# EAGLE design Power Supply 2 (EAGLE 8.6.0)
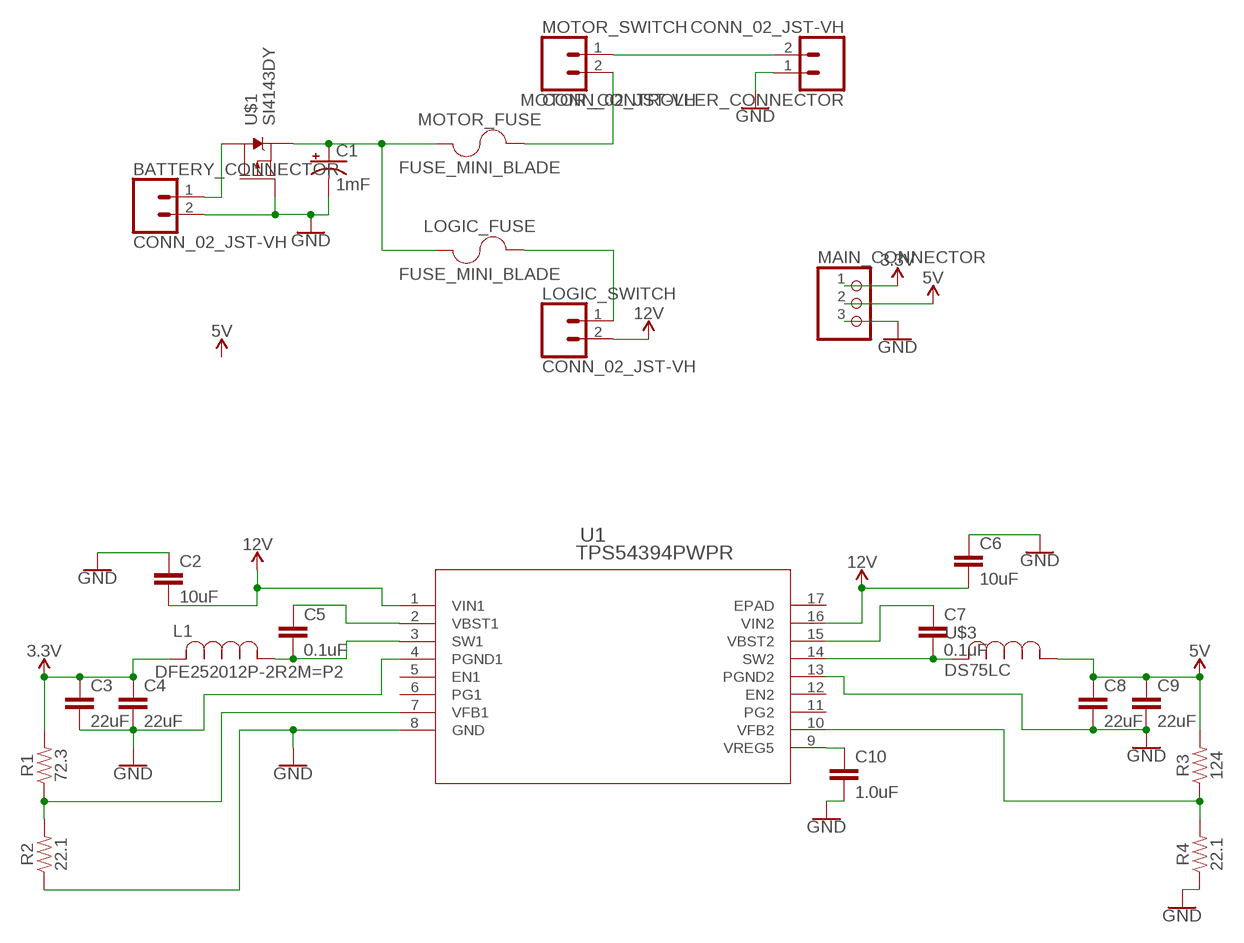
[diagram p0: schematic, sheet 1]

## Parts
BATTERY_CONNECTOR  CONN_02_JST-VH  [B2P-VH]
C1  1mF  1000UF-RADIAL-5MM-25V-20%  [CPOL-RADIAL-5MM-10MM]
C2  10uF  10UF-0805-10V-10%  [0805]
C3  22uF  22UF-0805-6.3V-20%  [0805]
C4  22uF  22UF-0805-6.3V-20%  [0805]
C5  0.1uF  0.1UF-0603-25V-5%  [0603]
C6  10uF  10UF-0805-10V-10%  [0805]
C7  0.1uF  0.1UF-0603-25V-5%  [0603]
C8  22uF  22UF-0805-6.3V-20%  [0805]
C9  22uF  22UF-0805-6.3V-20%  [0805]
C10  1.0uF  1.0UF-0805-25V-10%  [0805]
L1  DFE252012P-2R2M=P2  [DFE252012P-1R0M=P2]
LOGIC_FUSE  FUSE_MINI_BLADE  [SL-1538]
LOGIC_SWITCH  CONN_02_JST-VH  [B2P-VH]
MAIN_CONNECTOR  PINHD-1X3  [1X03]
MOTOR_CONTROLLER_CONNECTOR  CONN_02_JST-VH  [B2P-VH]
MOTOR_FUSE  FUSE_MINI_BLADE  [SL-1538]
MOTOR_SWITCH  CONN_02_JST-VH  [B2P-VH]
R1  72.3  75KOHM-0603-1/10W-1%  [0603]
R2  22.1  75KOHM-0603-1/10W-1%  [0603]
R3  124  75KOHM-0603-1/10W-1%  [0603]
R4  22.1  75KOHM-0603-1/10W-1%  [0603]
U1  TPS54394PWPR  [PWP16_3P4X2P46]
U$1  SI4143DY  [SO-8]
U$3  DS75LC  [DS75LC]

## Nets
3.3V: C3.1 C4.1 L1.2 MAIN_CONNECTOR.1 R1.2
5V: C8.1 C9.1 MAIN_CONNECTOR.2 R3.2 U$3.P$1
12V: C2.2 C6.2 LOGIC_SWITCH.2 U1.1(VIN1) U1.16(VIN2)
GND: BATTERY_CONNECTOR.2 C1.- C2.1 C3.2 C4.2 C6.1 C8.2 C9.2 C10.2 MAIN_CONNECTOR.3 MOTOR_CONTROLLER_CONNECTOR.1 R2.1 R4.1 U1.4(PGND1) U1.8(GND) U1.13(PGND2) U$1.4(G)
N$1: BATTERY_CONNECTOR.1 U$1.5(D) U$1.6(D) U$1.7(D) U$1.8(D)
N$2: MOTOR_FUSE.P$2 MOTOR_SWITCH.2
N$3: C1.+ LOGIC_FUSE.P$1 MOTOR_FUSE.P$1 U$1.1(S) U$1.2(S) U$1.3(S)
N$4: LOGIC_FUSE.P$2 LOGIC_SWITCH.1
N$5: MOTOR_CONTROLLER_CONNECTOR.2 MOTOR_SWITCH.1
N$6: C5.1 U1.2(VBST1)
N$7: C5.2 L1.1 U1.3(SW1)
N$8: C7.1 U1.15(VBST2)
N$9: R1.1 R2.2 U1.7(VFB1)
N$10: C7.2 U1.14(SW2) U$3.P$2
N$11: C10.1 U1.9(VREG5)
N$14: R3.1 R4.2 U1.10(VFB2)
Unconnected: U1.5(EN1) U1.6(PG1) U1.11(PG2) U1.12(EN2) U1.17(EPAD)

## Library data of the parts
BATTERY_CONNECTOR LOGIC_SWITCH MOTOR_CONTROLLER_CONNECTOR MOTOR_SWITCH = JST-VH:CONN_02_JST-VH: B2P-VH(LF)(SN) Digikey <https://www.digikey.com.au/product-detail/en/jst-sales-america-inc/B2P-VH-LF-SN/455-1639-ND/926547>
C1 = SparkFun-Capacitors:1000UF: 1,000µF/1mF ceramic capacitors A capacitor is a passive two-terminal electrical component used to store electrical energy temporarily in an electric field. CAP-08070; PROD_ID: CAP-09538
C2 C6 = SparkFun-Capacitors:10UF: 10.0µF ceramic capacitors A capacitor is a passive two-terminal electrical component used to store electrical energy temporarily in an electric field.; PROD_ID: CAP-11330
C3 C4 C8 C9 = SparkFun-Capacitors:22UF: 22µF ceramic capacitors A capacitor is a passive two-terminal electrical component used to store electrical energy temporarily in an electric field.; PROD_ID: CAP-08402
C5 C7 = SparkFun-Capacitors:0.1UF: 0.1µF ceramic capacitors A capacitor is a passive two-terminal electrical component used to store electrical energy temporarily in an electric field.; PROD_ID: CAP-08604
C10 = SparkFun-Capacitors:1.0UF: 1µF ceramic capacitors A capacitor is a passive two-terminal electrical component used to store electrical energy temporarily in an electric field.; PROD_ID: CAP-08064
L1 = Inductor:DFE252012P-2R2M=P2; MANUFACTURER_PART_NUMBER: DFE252012P2R2M=P2; VENDOR: Murata
LOGIC_FUSE MOTOR_FUSE = Fuse_Holder:FUSE_MINI_BLADE: SL-1538 Aliexpress <https://www.aliexpress.com/item/SL-1538-MINI-Style-Blade-Fuse-Holers-PCB-Mount-Fuse-holders-0153008/503553051.html>
MAIN_CONNECTOR = PinHead+:PINHD-1X3: PIN HEADER
R1-R4 = SparkFun-Resistors:75KOHM: 75Ω resistor A resistor is a passive two-terminal electrical component that implements electrical resistance as a circuit element. Resistors act to reduce current flow, and, at the same time, act to lower voltage levels within circuits. - Wikipedia; PROD_ID: RES-09737; VALUE: 75
U1 = TPS54394PWP:TPS54394PWPR; MANUFACTURER_PART_NUMBER: TPS54394PWPR; VENDOR: Texas Instruments
U$1 = MOSFET:SI4143DY: MOSFET P-CHANNEL 30V 25.3A 8SO Digikey <https://www.digikey.com.au/product-detail/en/vishay-siliconix/SI4143DY-T1-GE3/SI4143DY-T1-GE3CT-ND/6834487>
U$3 = Inductor:DS75LC

## Board
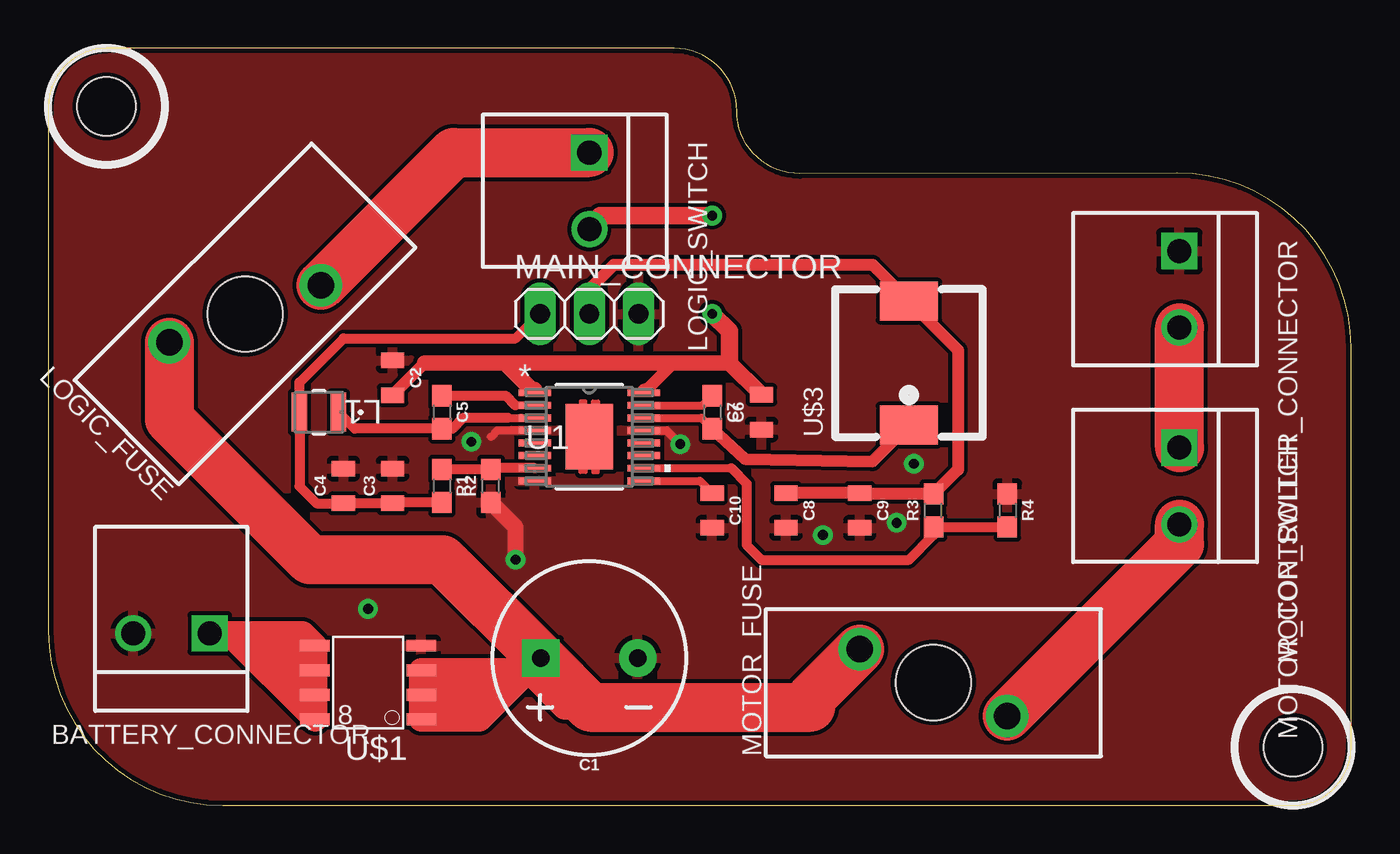
[diagram p1: board, top side]
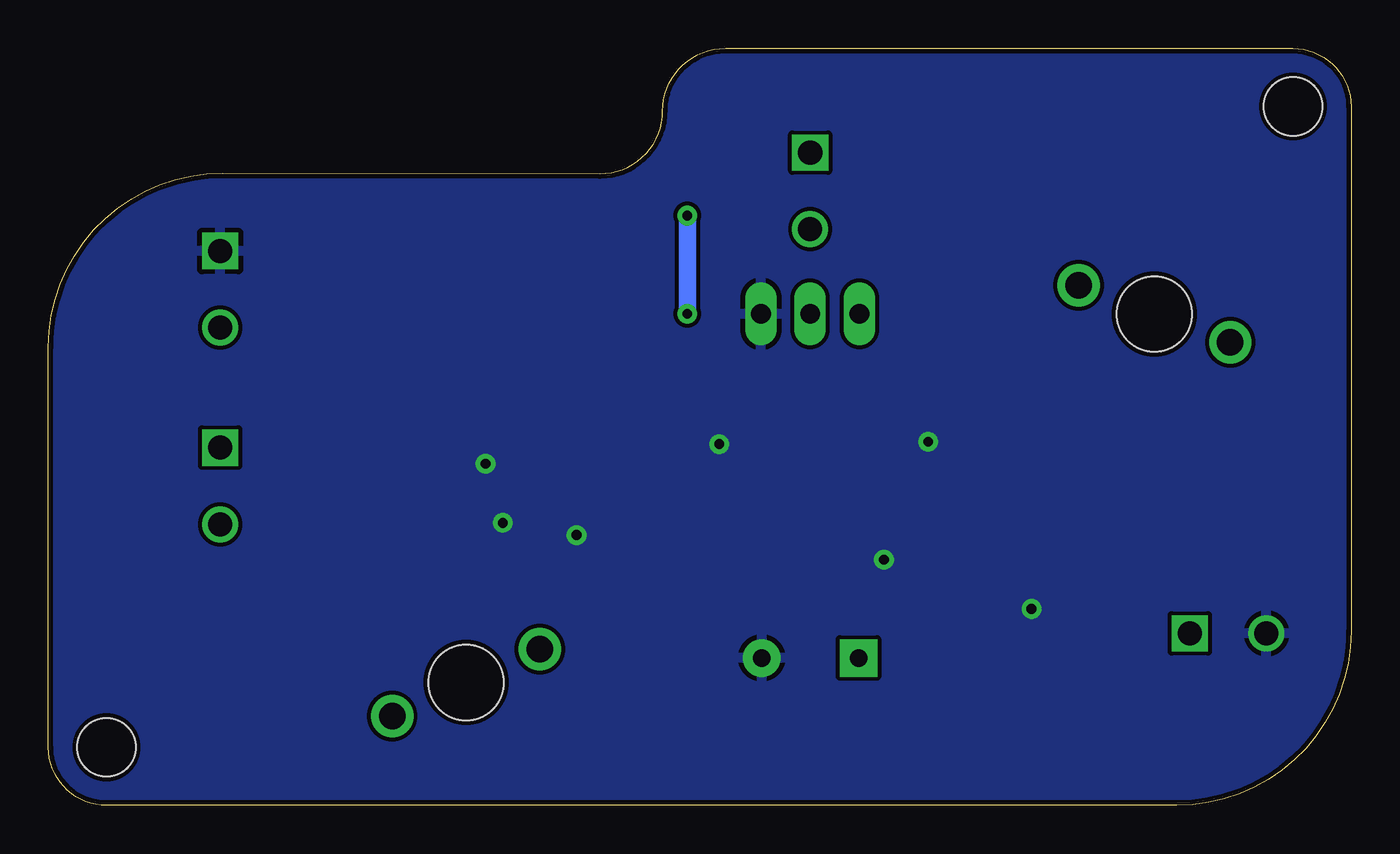
[diagram p2: board, bottom side, seen from below]

Size 67.29 x 39.12 mm. Coordinates in mm from the lower left corner, seen from the top.
Outline: 0,36.12 0,9 arc90 9,0 64.29,0 arc90 67.29,3 67.29,23.68 arc90 58.28,32.68 38.8,32.64 arc-90 35.56,35.88 arc90 32.32,39.12 3,39.12 arc90 0,36.12
Copper layers (1*16): Top 0.035mm / dielectric 1.5mm / Bottom 0.035mm
Design rules "SparkFun": minimum track width 8mil, minimum drill 20mil, track to track 8mil, track to pad 8mil, pad to pad 8mil, via to via 8mil, smd to smd 8mil, copper to edge 10mil, drill to drill 8mil, minimum pad ring 12mil, minimum via ring 10mil, stop-mask expansion 4mil, vias tented up to drill 25mil, thermal gap 10mil
Holes 3 mm at 3,36.12 64.29,3

### Footprints (pad centres in the part's own frame; a part is rotated, then mirrored left to right if it is on the bottom)
B2P-VH = drill 1.25 square: 1 -1.98,0 | drill 1.24: 2 1.98,0
CPOL-RADIAL-5MM-10MM = drill 0.9 pad 1.93 square: + 2.5,0 | drill 0.9 pad 1.93: - -2.5,0
0805 = smd 0.8 x 1.2: 1 -0.9,0; 2 0.9,0
0603 = smd 1.1 x 1: 1 -0.85,0; 2 0.85,0
DFE252012P-1R0M=P2 = smd 0.8 x 2.007: 1 -1,0; 2 1,0
SL-1538 = drill 1.37 pad 2.184: P$1 1.73,3.81; P$2 -1.73,-3.81 | hole 3.88: 0,0
1X03 = drill 1.016 long: 1 -2.54,0; 2 0,0; 3 2.54,0
PWP16_3P4X2P46 = smd 1.676 x 0.356: 1 -2.819,2.275; 2 -2.819,1.625; 3 -2.819,0.975; 4 -2.819,0.325; 5 -2.819,-0.325; 6 -2.819,-0.975; 7 -2.819,-1.625; 8 -2.819,-2.275; 9 2.819,-2.275; 10 2.819,-1.625; 11 2.819,-0.975; 12 2.819,-0.325; 13 2.819,0.325; 14 2.819,0.975; 15 2.819,1.625; 16 2.819,2.275 | smd 2.46 x 3.4: 17 0,0
SO-8 = smd 1.524 x 0.61: 1 -2.743,1.905; 2 -2.743,0.635; 3 -2.743,-0.635; 4 -2.743,-1.905; 5 2.743,-1.905; 6 2.743,-0.635; 7 2.743,0.635; 8 2.743,1.905
DS75LC = smd 2 x 3: P$1 3.2,0; P$2 -3.2,0

### Placement (x,y rotation side)
BATTERY_CONNECTOR  6.35,8.89 180 top
C1  27.94,7.62 180 top
C2  17.78,22.1 270 top
C3  17.78,16.51 90 top
C4  15.24,16.51 90 top
C5  20.32,20.32 270 top
C6  36.83,20.32 90 top
C7  34.29,20.32 270 top
C8  38.1,15.24 270 top
C9  41.91,15.24 270 top
C10  34.29,15.24 270 top
L1  13.97,20.32 180 top
LOGIC_FUSE  10.16,25.4 135 top
LOGIC_SWITCH  27.94,31.75 270 top
MAIN_CONNECTOR  27.94,25.4 0 top
MOTOR_CONTROLLER_CONNECTOR  58.42,26.67 270 top
MOTOR_FUSE  45.72,6.35 90 top
MOTOR_SWITCH  58.42,16.51 270 top
R1  20.32,16.51 270 top
R2  22.86,16.51 90 top
R3  45.72,15.24 90 top
R4  49.53,15.24 270 top
U1  27.94,19.05 0 top
U$1  16.51,6.35 180 top
U$3  44.45,22.86 90 top

### Tracks (layer width: path | path; a pad name or v marks a point on that pad's centre or on a via)
3.3V
  Top 0.508: R1.2 17.83,15.66 C3.1 C4.1 13.85,15.61 12.97,16.49 L1.2 12.97,21.86 15.24,24.13 24.13,24.13 MAIN_CONNECTOR.1
5V
  Top 0.61: C8.1 C9.1 41.96,16.09 R3.2 46.99,17.36 46.99,23.52 U$3.P$1 42.57,27.94 29.21,27.94 27.94,26.67 MAIN_CONNECTOR.2
12V  (via drill 0.51)
  Top 0.305: U1.16 30.92,21.49
  Top 0.406: U1.1 24.96,21.49
  Top 0.61: 32.29,22.86 30.92,21.49 30.76,21.49 | C2.2 19.42,22.86
  Top 0.813: C6.2 35.19,22.86 32.29,22.86 23.59,22.86 | 23.59,22.86 24.96,21.49 25.12,21.49 | 19.42,22.86 23.59,22.86
  Top 0.914: 35.19,22.86 35.19,24.5 v34.29,25.4 | 33.73,30.48 v34.29,30.48 28.5,30.48 LOGIC_SWITCH.2
  Bottom 0.914: v34.29,25.4 v34.29,30.48
GND  (via drill 0.51)
  Top 0.406: U1.13 31.93,19.38 v32.64,18.67 | U1.4 23.18,19.38 22.86,19.05
  Top 0.813: R2.1 24.13,14.39 v24.13,12.7
  other vias: 40,13.97 43.81,14.61 44.7,17.65 16.51,10.16 21.84,18.8
  pour Bottom: 148.59,109.22 -19.05,109.22 -63.5,64.77 -63.5,0 -30.48,-33.02 154.94,-33.02 182.88,-5.08 182.88,90.17 168.91,104.14 163.83,109.22
  pour Top: 41.91,114.3 1.27,114.3 -15.24,97.79 -58.42,54.61 -58.42,24.13 -58.42,-15.24 -44.45,-29.21 172.72,-29.21 189.23,-12.7 193.04,-8.89 193.04,102.87 181.61,114.3
N$1
  Top 1.27: BATTERY_CONNECTOR.1 13.13,8.89 U$1.5 U$1.6 | U$1.6 U$1.7 | U$1.7 U$1.8 9.32,8.89 BATTERY_CONNECTOR.1 | BATTERY_CONNECTOR.1 10.59,8.89 U$1.7 | BATTERY_CONNECTOR.1 11.86,8.89 U$1.6
N$2
  Top 2.54: MOTOR_FUSE.P$2 58.42,13.51 MOTOR_SWITCH.2
N$3
  Top 1.27: U$1.2 U$1.1 22.27,4.45 23.54,5.71 | U$1.2 U$1.3 | U$1.3 24.8,6.99 C1.+ | C1.+ 25.44,7.58 27.94,5.08 | MOTOR_FUSE.P$1 41.91,7.62 39.37,5.08 27.94,5.08 | 23.54,5.71 C1.+ | U$1.2 23.54,5.71 | U$1.3 24.77,6.99 26.67,5.08 27.94,5.08
  Top 2.54: MOTOR_FUSE.P$1 39.37,5.54 39.37,5.08 27.98,5.08 C1.+ 20.36,12.7 13.51,12.7 6.24,19.97 LOGIC_FUSE.P$1
N$4
  Top 2.54: LOGIC_FUSE.P$2 20.94,33.73 LOGIC_SWITCH.1
N$5
  Top 2.54: MOTOR_SWITCH.1 MOTOR_CONTROLLER_CONNECTOR.2
N$6
  Top 0.406: U1.2 24.11,20.68
  Top 0.508: C5.1 23.61,21.17 24.11,20.68
N$7
  Top 0.406: 23.74,20.04 23.81,20.04 23.83,20.02 24.38,20.02 24.39,20.02 U1.3
  Top 0.508: L1.1 15.82,19.47 C5.2 20.87,19.47 21.43,20.04 23.74,20.04
N$8
  Top 0.406: U1.15 33.79,20.68 C7.1
N$9
  Top 0.508: U1.7 22.93,17.43 R2.2 R1.1
N$10
  Top 0.406: U1.14 33.73,20.02 C7.2
  Top 0.61: C7.2 35.98,17.91 42.57,17.78 U$3.P$2
N$11
  Top 0.406: U1.9 33.65,16.77 C10.1
N$14
  Top 0.406: U1.10 35.28,17.43
  Top 0.508: 35.28,17.43 36.07,16.64 36.07,13.46 36.83,12.7 44.45,12.7 45.72,13.97 R3.1 R4.2